# EAGLE design RPi-HAT_BUS-Controller_V0.5 (EAGLE 7.4.0)
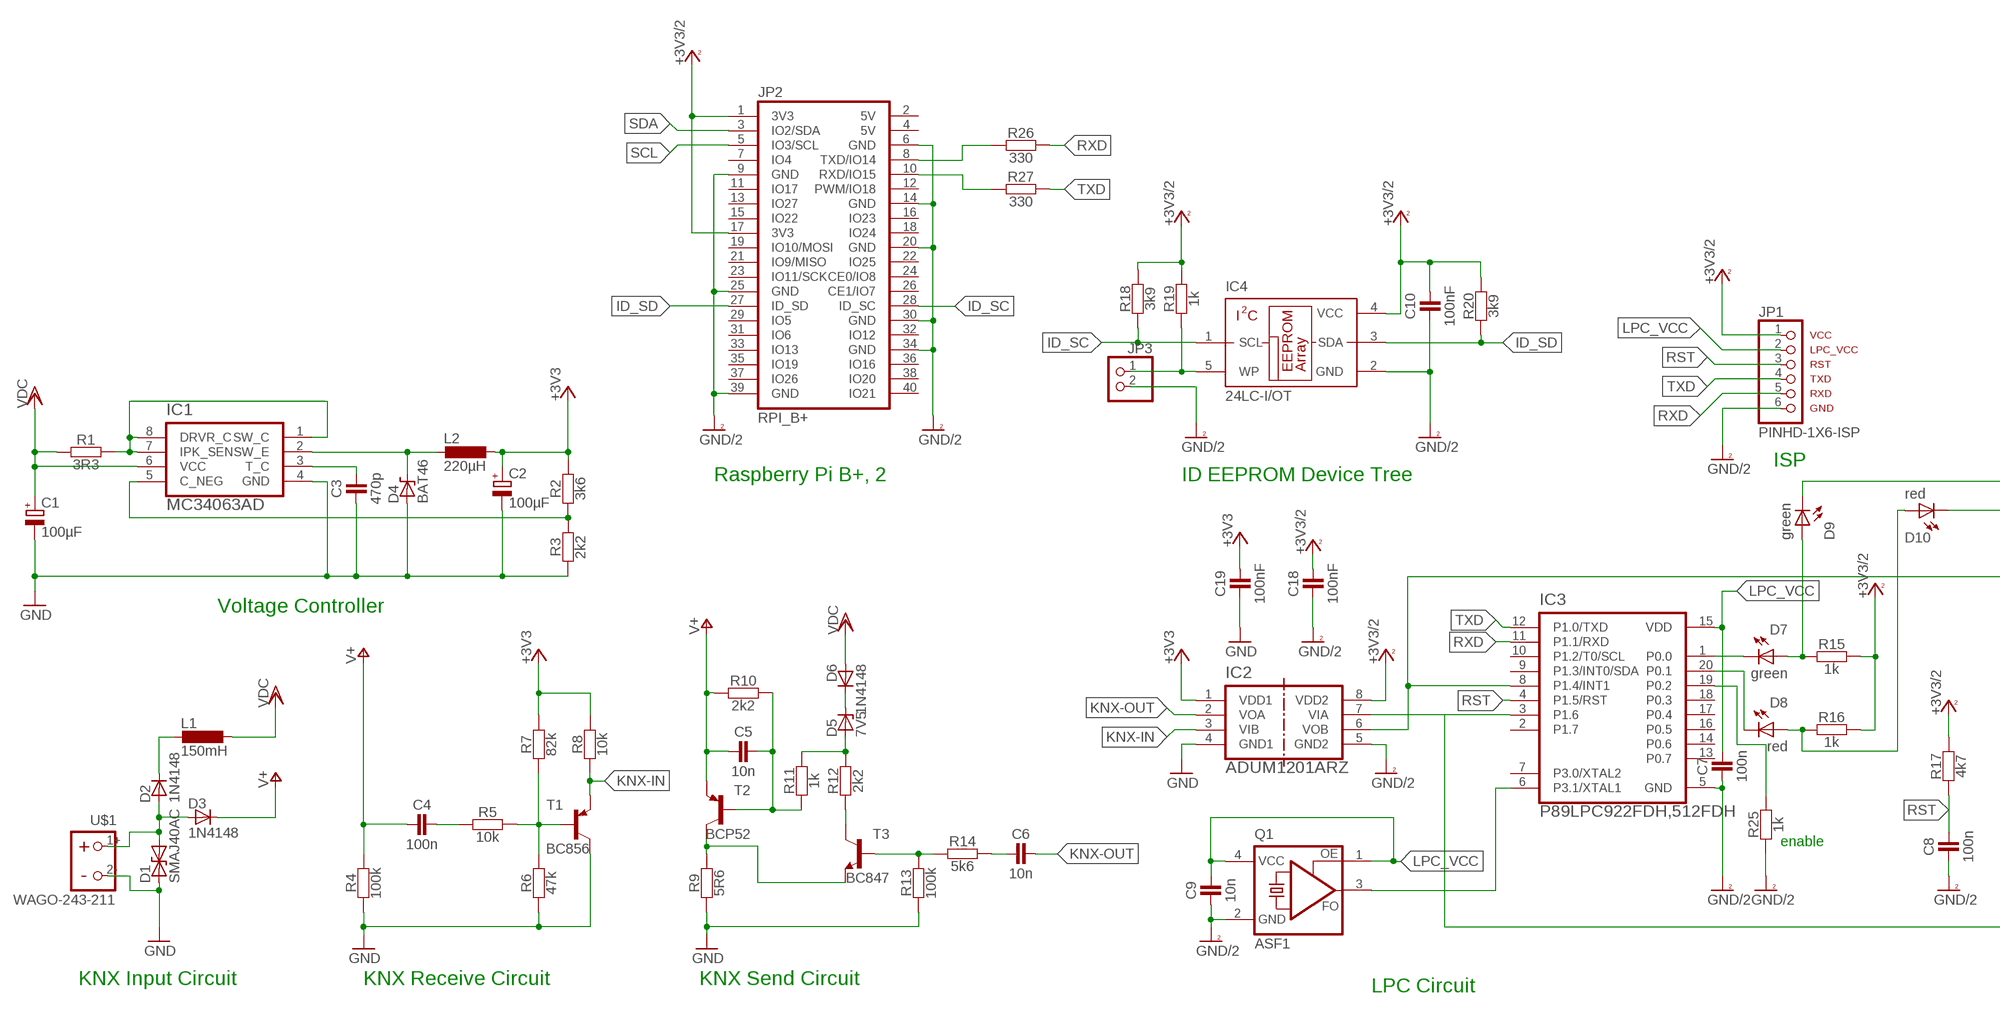
[diagram p0: schematic, sheet 1, part 1 of 2]
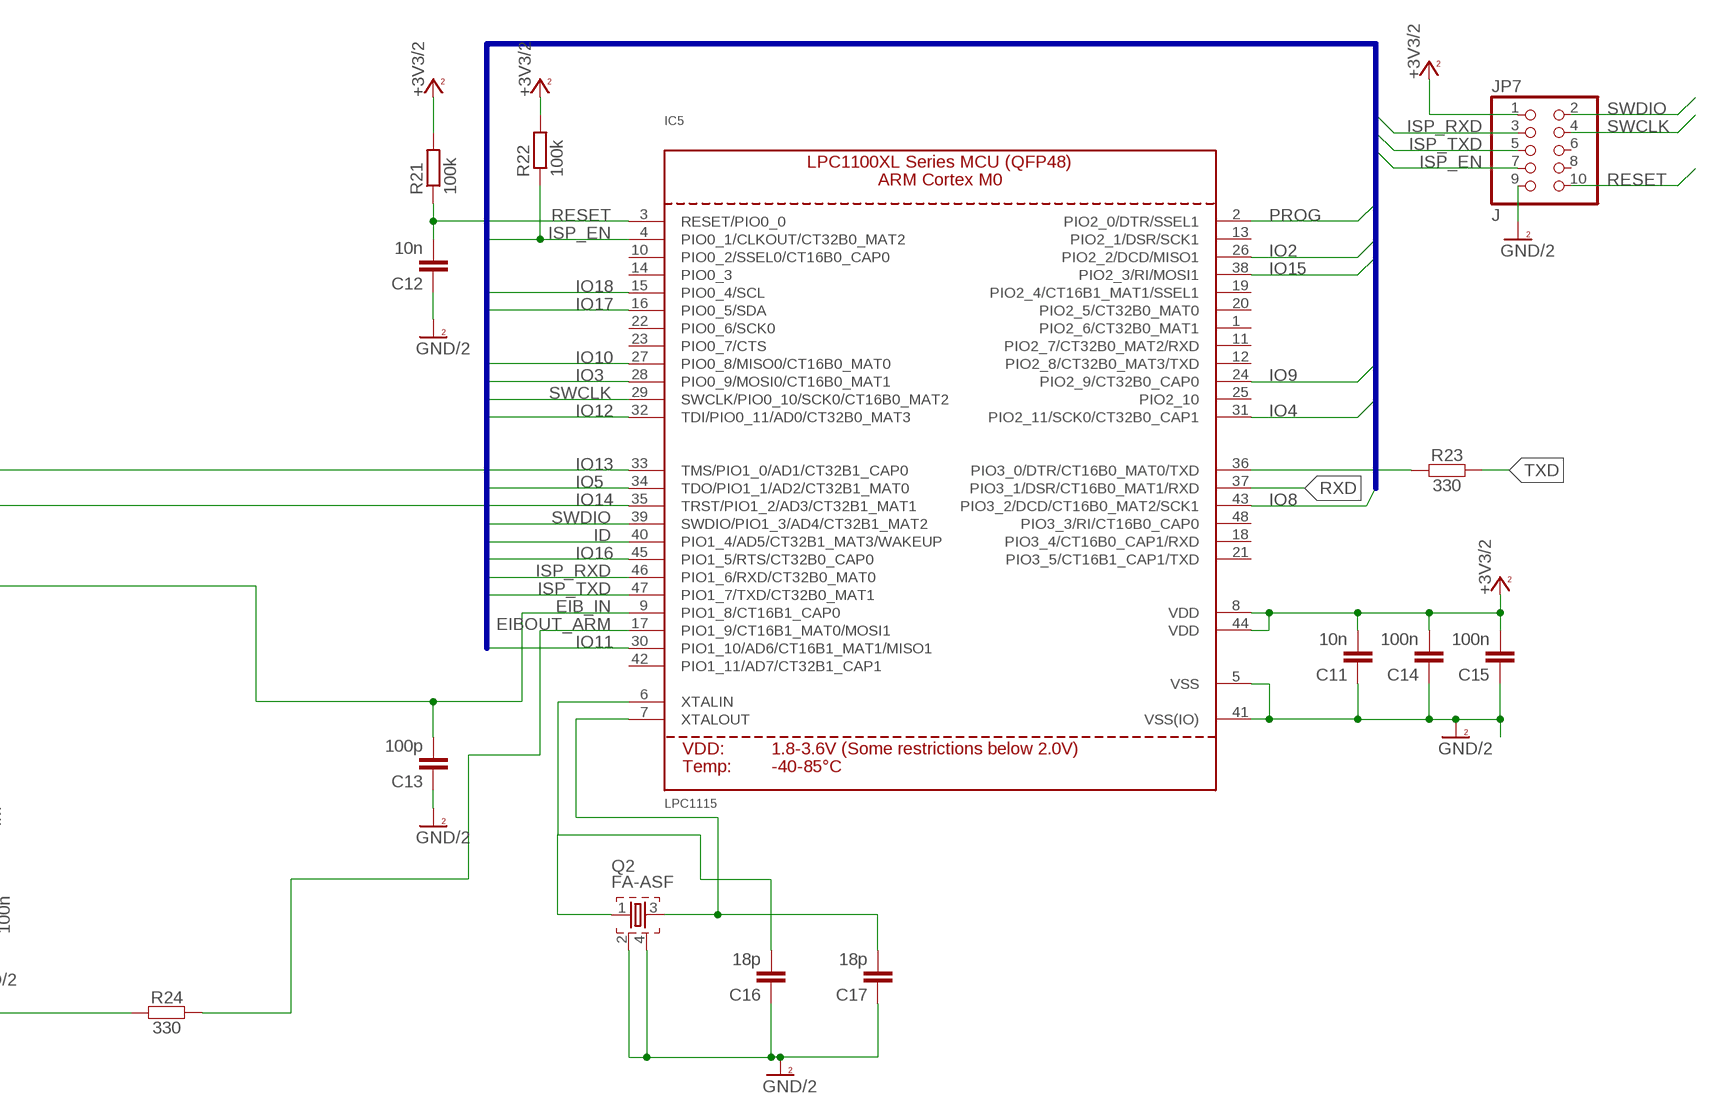
[diagram p1: schematic, sheet 1, part 2 of 2]

## Parts
C1  100µF  100µF,35V  [PANASONIC_D]
C2  100µF  100µF,6.3V  [PANASONIC_C]
C3  470p  CAPACITORC1206  [R1206]
C4  100n  CAPACITORC1206  [R1206]
C5  10n  CAPACITORC1206  [R1206]
C6  10n  CAPACITORC1206  [R1206]
C7  100n  CAPACITORC1206  [R1206]
C8  100n  CAPACITORC1206  [R1206]
C9  10n  CAPACITORC1206  [R1206]
C10  100nF  CAPACITORC1206  [R1206]
C11  10n  C-EUC1206  [C1206]
C12  10n  C-EUC1206  [C1206]
C13  100p  C-EUC1206  [C1206]
C14  100n  C-EUC1206  [C1206]
C15  100n  C-EUC1206  [C1206]
C16  18p  C-EUC1206  [C1206]
C17  18p  C-EUC1206  [C1206]
C18  100nF  CAPACITORC1206  [R1206]
C19  100nF  CAPACITORC1206  [R1206]
D1  SMAJ40AC  [DO-214AC]
D2  1N4148  1N4148MINIMELF  [MINIMELF]
D3  1N4148  1N4148MINIMELF  [MINIMELF]
D4  BAT46  [MINIMELF]
D5  7V5  Z-DIODE  [MINIMELF]
D6  1N4148  1N4148MINIMELF  [MINIMELF]
D7  green  LED1206  [CHIPLED_1206]
D8  red  LED1206  [CHIPLED_1206]
D9  green  LED1206  [CHIPLED_1206]
D10  red  LED1206  [CHIPLED_1206]
IC1  MC34063AD  [SOIC127P600X175-8N]
IC2  ADUM1201ARZ  [SOIC127P600X175-8N]
IC3  P89LPC922FDH,512FDH  [SOP65P640X110-20N]
IC4  24LC-I/OT  [SOT23-5]
IC5  LPC1115  LPC1113/4/5_QFP48_XLSERIES  [LQFP48]
JP1  PINHD-1X6-ISP  [1X06]
JP2  RPI_B+  [RPI-B+HAT]
JP3  PINHD-1X2  [1X02]
JP7  J  PINHD-2X05_2.00  [2X05M]
L1  150mH  150MH-L11PL1  [11P-L1]
L2  220µH  220µH-SMCC11.43  [2200-11.43]
Q1  ASF1  [ASF]
Q2  FA-ASF  [ASF]
R1  3R3  RESISTORR1206  [R1206]
R2  3k6  RESISTORR1206  [R1206]
R3  2k2  RESISTORR1206  [R1206]
R4  100k  RESISTORR1206  [R1206]
R5  10k  RESISTORR1206  [R1206]
R6  47k  RESISTORR1206  [R1206]
R7  82k  RESISTORR1206  [R1206]
R8  10k  RESISTORR1206  [R1206]
R9  5R6  RESISTORR1206  [R1206]
R10  2k2  RESISTORR1206  [R1206]
R11  1k  RESISTORR1206  [R1206]
R12  2k2  RESISTORR1206  [R1206]
R13  100k  RESISTORR1206  [R1206]
R14  5k6  RESISTORR1206  [R1206]
R15  1k  RESISTORR1206  [R1206]
R16  1k  RESISTORR1206  [R1206]
R17  4k7  RESISTORR1206  [R1206]
R18  3k9  RESISTORR1206  [R1206]
R19  1k  RESISTORR1206  [R1206]
R20  3k9  RESISTORR1206  [R1206]
R21  100k  R-EU_R1206  [R1206]
R22  100k  R-EU_R1206  [R1206]
R23  330  RESISTORR1206  [R1206]
R24  330  RESISTORR1206  [R1206]
R25  1k  RESISTORR1206  [R1206]
R26  330  RESISTORR1206  [R1206]
R27  330  RESISTORR1206  [R1206]
T1  BC856  PNPBC856  [SOT23]
T2  BCP52  PNPBCP52  [SOT223]
T3  BC847  NPN-BC847  [SOT23]
U$1  WAGO-243-211  [WAGO-243-211]

## Nets
+3V3: C2.+ C19.2 IC2.1(VDD1) L2.1 R2.2 R7.2 R8.2
+3V3/2: C10.2 C11.2 C14.2 C15.2 C18.2 IC2.8(VDD2) IC4.4(VCC) IC5.8(VDD) IC5.44(VDD) JP1.1 JP2.1(3V3) JP2.17(3V3) JP7.1 R15.2 R16.2 R17.2 R18.2 R19.2 R20.2 R21.2 R22.2
EIB_IN: C13.2 IC2.6(VOB) IC3.8(P1.4/INT1) IC5.9(PIO1_8/CT16B1_CAP0)
EIB_OUT: IC2.7(VIA) IC3.3(P1.6) R24.1
EIBOUT_ARM: IC5.17(PIO1_9/CT16B1_MAT0/MOSI1) R24.2
GND: C1.- C2.- C3.1 C19.1 D1.A D4.A IC1.4(GND) IC2.4(GND1) R3.1 R4.1 R6.1 R9.1 R13.1 T1.3(C) U$1.2-
GND/2: C7.1 C8.1 C9.1 C10.1 C11.1 C12.1 C13.1 C14.1 C15.1 C16.1 C17.1 C18.1 IC2.5(GND2) IC3.5(GND) IC4.2(GND) IC5.5(VSS) IC5.41(VSS(IO)) JP1.6 JP2.6(GND) JP2.9(GND) JP2.14(GND) JP2.20(GND) JP2.25(GND) JP2.30(GND) JP2.34(GND) JP2.39(GND) JP3.2 JP7.9 Q1.2(GND) Q2.2 Q2.4 R25.1
ID: IC5.40(PIO1_4/AD5/CT32B1_MAT3/WAKEUP)
ID_SC: IC4.1(SCL) JP2.28(ID_SC) R18.1
ID_SD: IC4.3(SDA) JP2.27(ID_SD) R20.1
IO2: IC5.26(PIO2_2/DCD/MISO1)
IO3: IC5.28(PIO0_9/MOSI0/CT16B0_MAT1)
IO4: IC5.31(PIO2_11/SCK0/CT32B0_CAP1)
IO5: IC5.34(TDO/PIO1_1/AD2/CT32B1_MAT0)
IO8: IC5.43(PIO3_2/DCD/CT16B0_MAT2/SCK1)
IO9: IC5.24(PIO2_9/CT32B0_CAP0)
IO10: IC5.27(PIO0_8/MISO0/CT16B0_MAT0)
IO11: IC5.30(PIO1_10/AD6/CT16B1_MAT1/MISO1)
IO12: D10.C IC5.32(TDI/PIO0_11/AD0/CT32B0_MAT3)
IO13: IC5.33(TMS/PIO1_0/AD1/CT32B1_CAP0)
IO14: IC5.35(TRST/PIO1_2/AD3/CT32B1_MAT1)
IO15: D9.C IC5.38(PIO2_3/RI/MOSI1)
IO16: IC5.45(PIO1_5/RTS/CT32B0_CAP0)
IO17: IC5.16(PIO0_5/SDA)
IO18: IC5.15(PIO0_4/SCL)
ISP_EN: IC5.4(PIO0_1/CLKOUT/CT32B0_MAT2) JP7.7 R22.1
ISP_RXD: IC5.46(PIO1_6/RXD/CT32B0_MAT0) JP7.3
ISP_TXD: IC5.47(PIO1_7/TXD/CT32B0_MAT1) JP7.5
KNX-IN: IC2.3(VIB) R8.1 T1.2(E)
KNX-OUT: C6.2 IC2.2(VOA)
LPC_VCC: C7.2 C9.2 IC3.15(VDD) JP1.2 Q1.1(OE) Q1.4(VCC)
N$1: D1.C D2.A D3.A U$1.1+
N$2: C16.2 IC5.6(XTALIN) Q2.1
N$3: IC1.5(C_NEG) R2.1 R3.2
N$4: C4.2 R5.1
N$5: D2.C L1.2
N$6: R5.2 R6.2 R7.1 T1.1(B)
N$7: C17.2 IC5.7(XTALOUT) Q2.3
N$8: IC1.1(SW_C) IC1.7(IPK_SEN) IC1.8(DRVR_C) R1.2
N$9: D8.C IC3.20(P0.1)
N$10: C3.2 IC1.3(T_C)
N$11: D7.C IC3.1(P0.0)
N$12: IC4.5(WP) JP3.1 R19.1
N$13: D4.C IC1.2(SW_E) L2.2
N$14: IC3.19(P0.2) R25.2
N$17: JP2.8(TXD/IO14) R26.1
N$18: JP2.10(RXD/IO15) R27.1
N$23: R9.2 T2.2(C) T2.4(C) T3.2(E)
N$24: C5.2 R10.2 R11.1 T2.1(B)
N$25: D5.A R11.2 R12.2
N$26: R12.1 T3.3(C)
N$28: R13.2 R14.1 T3.1(B)
N$29: C6.1 R14.2
N$31: D5.C D6.C
N$32: IC3.6(P3.1/XTAL1) Q1.3(FO)
N$35: D7.A D9.A R15.1
N$38: D8.A D10.A R16.1
PROG: IC5.2(PIO2_0/DTR/SSEL1)
RESET: C12.2 IC5.3(RESET/PIO0_0) JP7.10 R21.1
RST: C8.2 IC3.4(P1.5/RST) JP1.3 R17.1
RXD: IC3.11(P1.1/RXD) IC5.37(PIO3_1/DSR/CT16B0_MAT1/RXD) JP1.5 R26.2
SCL: JP2.5(IO3/SCL)
SDA: JP2.3(IO2/SDA)
SWCLK: IC5.29(SWCLK/PIO0_10/SCK0/CT16B0_MAT2) JP7.4
SWDIO: IC5.39(SWDIO/PIO1_3/AD4/CT32B1_MAT2) JP7.2
TXD: IC3.12(P1.0/TXD) JP1.4 R23.2 R27.2
TXD_ARM: IC5.36(PIO3_0/DTR/CT16B0_MAT0/TXD) R23.1
V+: C4.1 C5.1 D3.C R4.2 R10.1 T2.3(E)
VDD: C1.+ D6.A IC1.6(VCC) L1.1 R1.1 ; supply symbol labelled VDC
Unconnected: IC3.2(P1.7) IC3.7(P3.0/XTAL2) IC3.9(P1.3/INT0/SDA) IC3.10(P1.2/T0/SCL) IC3.13(P0.7) IC3.14(P0.6) IC3.16(P0.5) IC3.17(P0.4) IC3.18(P0.3) IC5.1(PIO2_6/CT32B0_MAT1) IC5.10(PIO0_2/SSEL0/CT16B0_CAP0) IC5.11(PIO2_7/CT32B0_MAT2/RXD) IC5.12(PIO2_8/CT32B0_MAT3/TXD) IC5.13(PIO2_1/DSR/SCK1) IC5.14(PIO0_3) IC5.18(PIO3_4/CT16B0_CAP1/RXD) IC5.19(PIO2_4/CT16B1_MAT1/SSEL1) IC5.20(PIO2_5/CT32B0_MAT0) IC5.21(PIO3_5/CT16B1_CAP1/TXD) IC5.22(PIO0_6/SCK0) IC5.23(PIO0_7/CTS) IC5.25(PIO2_10) IC5.42(PIO1_11/AD7/CT32B1_CAP1) IC5.48(PIO3_3/RI/CT16B0_CAP0) JP2.2(5V) JP2.4(5V) JP2.7(IO4) JP2.11(IO17) JP2.12(PWM/IO18) JP2.13(IO27) JP2.15(IO22) JP2.16(IO23) JP2.18(IO24) JP2.19(IO10/MOSI) JP2.21(IO9/MISO) JP2.22(IO25) JP2.23(IO11/SCK) JP2.24(CE0/IO8) JP2.26(CE1/IO7) JP2.29(IO5) JP2.31(IO6) JP2.32(IO12) JP2.33(IO13) JP2.35(IO19) JP2.36(IO16) JP2.37(IO26) JP2.38(IO20) JP2.40(IO21) JP7.6 JP7.8

## Buses
IO[1..18],RESET,SWCLK,SWDIO,ISP_EN,PROG,ID,ISP_TXD,ISP_RXD

## Notes on the sheet
- ISP
- Raspberry Pi B+, 2 | ID EEPROM Device Tree
- Voltage Controller
- enable
- KNX Input Circuit | KNX Receive Circuit | KNX Send Circuit
- LPC Circuit

## Library data of the parts
C1 = RCL_for_Selfbus-Projects:100µF,35V: Polarized Capacitor 100µF, 35V
C2 = RCL_for_Selfbus-Projects:100µF,6.3V: Polarized Capacitor 100µF, 6.3V
C3-C10 C18 C19 = RCL_for_Selfbus-Projects:CAPACITOR: Capacitor
C11 C12 = rcl:C-EU: CAPACITOR, European symbol; REICHELT: X7R-G0805 10N
C13 = rcl:C-EU: CAPACITOR, European symbol; REICHELT: NPO-G0805 100P
C14 C15 = rcl:C-EU: CAPACITOR, European symbol; REICHELT: X7R-G0805 100N
C16 C17 = rcl:C-EU: CAPACITOR, European symbol
D1 = Diode:SMAJ40AC
D2 D3 = Diode:1N4148
D4 = Diode_for_Selfbus-Projects:BAT46: Schottky Diode
D5 = Diode_for_Selfbus-Projects:Z-DIODE: Z-Diode
D6 = Diode_for_Selfbus-Projects:1N4148: Diode
D7-D10 = Diode_for_Selfbus-Projects:LED: LED
IC1 = IC_for_Selfbus-Projects:MC34063A: DC/DC converter control circuit
IC2 = IC_for_Selfbus-Projects:ADUM1201ARZ: Dual-Channel Digital Isolators; MPN: ADUM1201ARZ; OC_FARNELL: 1078200; OC_NEWARK: 19M0753; PACKAGE: SOIC-8; SUPPLIER: Analog Devices
IC3 = IC_for_Selfbus-Projects:P89LPC922FDH,512: 8-bit microcontrollers with two-clock 80C51 core 2 kB/4 kB/8 kB 3 V low-power Flash with 256-byte data RAM; MPN: P89LPC922FDH,512; OC_FARNELL: 1895067; OC_NEWARK: 70R8570; PACKAGE: TSSOP-20; SUPPLIER: NXP
IC4 = IC_for_Selfbus-Projects:24LC*: Microchip I2C EEPROM 2 Kbit - 24LC02B - 24LC02BT-I/OTDKR-ND 32 Kbit- 24LC32A - 24LC32AT-I/OTDKR-ND; DIGIKEY: 24LC32AT-I/OTDKR-ND
IC5 = microbuilder:LPC1113/4/5_QFP48_XLSERIES: LPC1113/4/5 ARM Cortex M0 MCU (50MHz) - XL Series (FBD48/3x3) LPC1115FBD48/303: Max Frequency: 50MHz Flash: 64kB SRAM: 8kB ADC: 10-bit
JP1 = Connector_for_Selfbus-Projects:PINHD-1X6-ISP: PIN HEADER - ISP for Selfbus-Controller
JP2 = Connector_for_Selfbus-Projects:RPI_B+: RPi-B+ und RPi-B2 HAT
JP3 = Connector_for_Selfbus-Projects:PINHD-1X2: PIN HEADER
JP7 = pinhead-2:PINHD-2X05: PIN HEADER; REICHELT: MPE 150-3-010
L1 = RCL_for_Selfbus-Projects:150MH-L11P: Inductor 150mH
L2 = RCL_for_Selfbus-Projects:220µH-SMCC: Inductor 220µH
Q1 = IC_for_Selfbus-Projects:ASF*: CRYSTAL CLOCK OSCILLATORS 5.0 Vdc or 3.3 Vdc - LOW PROFILE ULTRA MINIATURE CERAMIC SURFACE MOUNT Source: http://www.abracon.com/Oscillators/asf1-L-L1.pdf; OC_FARNELL: unknown; OC_NEWARK: unknown
Q2 = crystal:FA-: MHz RANGE CRYSTAL UNIT Source: Epson Toyocom
R1-R20 R23-R27 = RCL_for_Selfbus-Projects:RESISTOR: Resistor
R21 R22 = rcl:R-EU_: RESISTOR, European symbol; REICHELT: SMD-0805 100K
T1 T2 = Transistor_for_Selfbus-Projects:PNP: PNP Transistor
T3 = Transistor_for_Selfbus-Projects:NPN: NPN Transistor
U$1 = Connector_for_Selfbus-Projects:WAGO-243-211: WAGO KNX-Busklemme

## Board
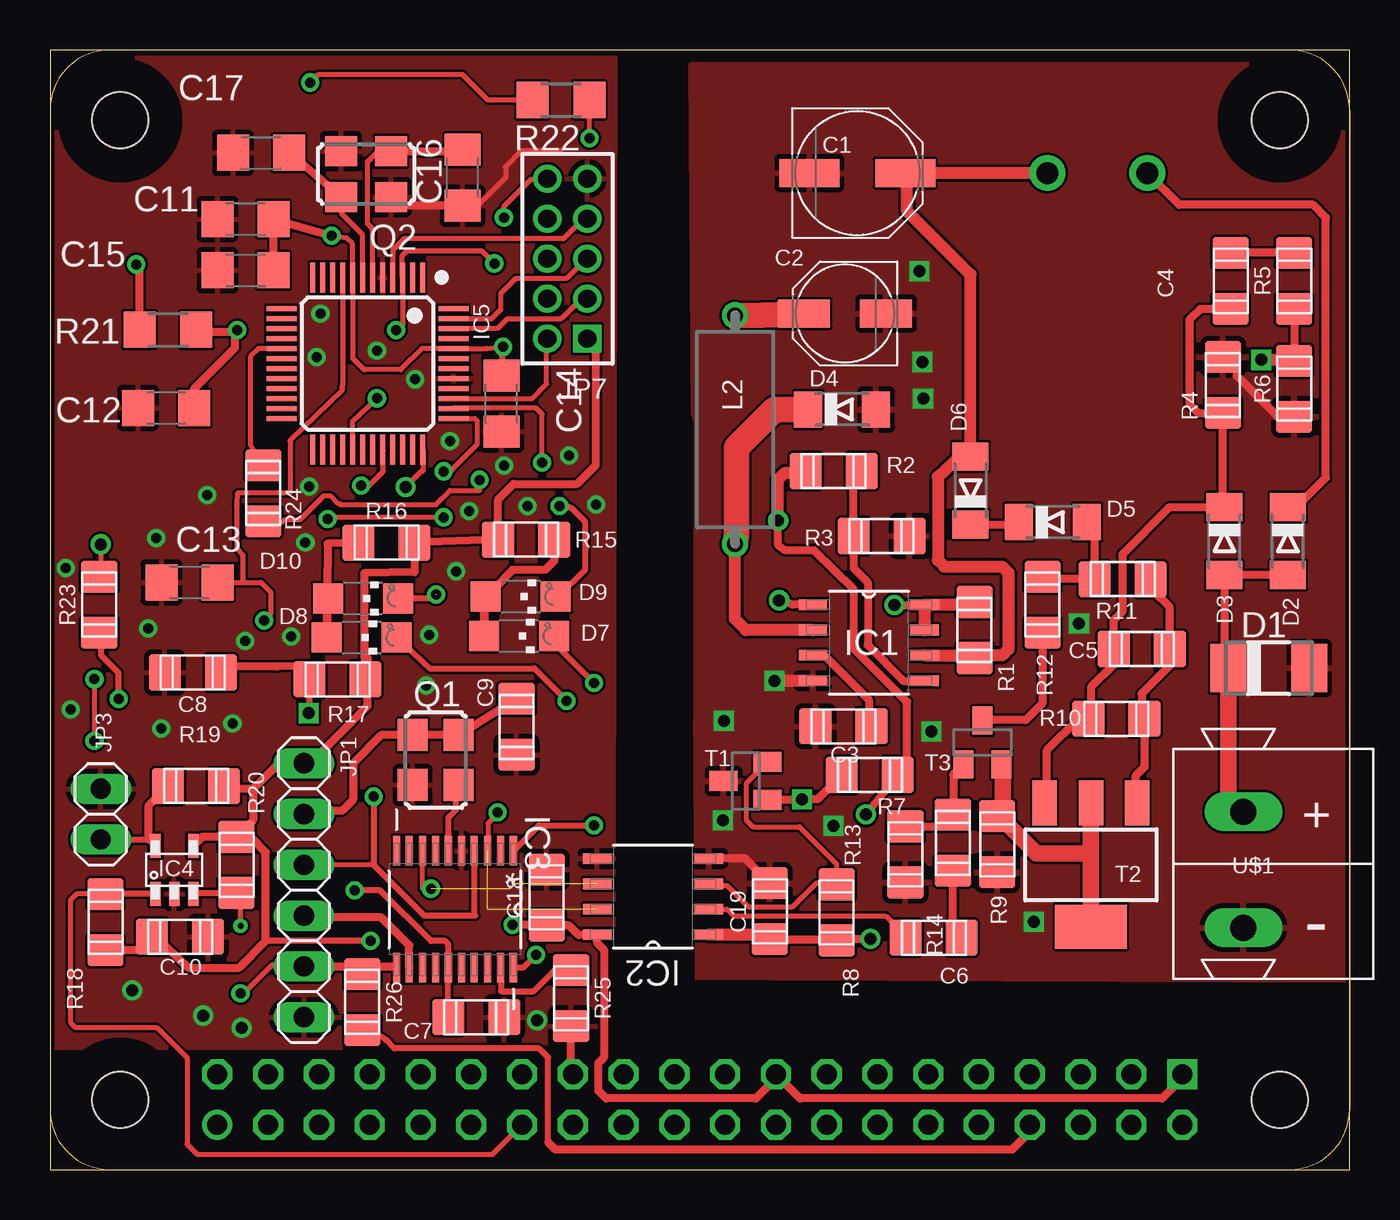
[diagram p2: board, top side]
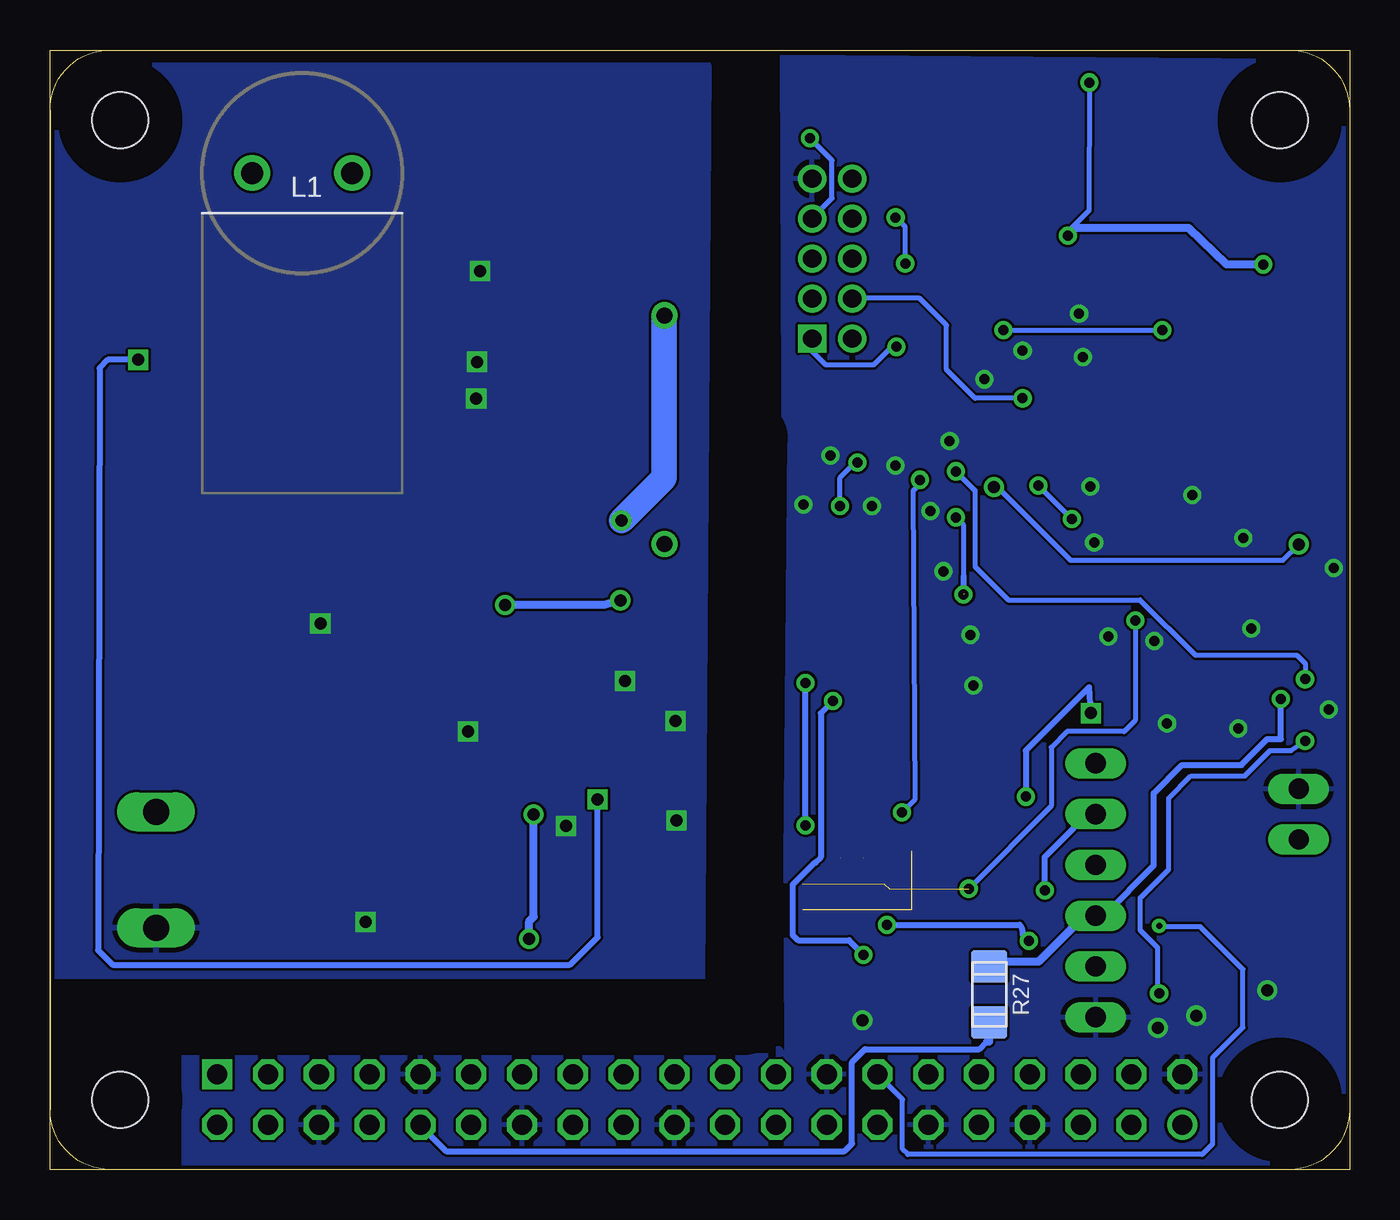
[diagram p3: board, bottom side, seen from below]

Size 65 x 56 mm. Coordinates in mm from the lower left corner, seen from the top.
Outline: 0,0 65,0 65,56 0,56 0,0
Copper layers (1*16): Top 0.035mm / dielectric 1.5mm / Bottom 0.035mm
Design rules "default *": minimum track width 8mil, minimum drill 0.3mm, track to track 5mil, track to pad 5mil, pad to pad 5mil, via to via 5mil, smd to smd 1mil, copper to edge 8mil, drill to drill 8mil, minimum pad ring 10mil, minimum via ring 8mil, stop-mask expansion 4mil, vias tented up to drill 0mil, thermal gap 10mil
tRestrict: 2 lines
bRestrict: 2 lines

### Footprints (pad centres in the part's own frame; a part is rotated, then mirrored left to right if it is on the bottom)
PANASONIC_D = smd 3 x 1.4: + 2.4,0; - -2.4,0
PANASONIC_C = smd 2.6 x 1.4: + 2.05,0; - -2.05,0
R1206 = smd 1.8 x 1.6: 1 0,1.4; 2 0,-1.4
C1206 = smd 1.6 x 1.8: 1 -1.4,0; 2 1.4,0
DO-214AC = smd 1.8 x 2.4: A 2.025,0; C -2.025,0
MINIMELF = smd 1.4 x 1.8: A 1.7,0; C -1.7,0
CHIPLED_1206 = smd 1.5 x 1.5: A -1.75,0; C 1.75,0
SOIC127P600X175-8N = smd 1.422 x 0.533: 1 -2.794,1.27; 2 -2.794,0; 3 -2.794,-1.27; 4 -2.794,-2.54; 5 2.794,-2.54; 6 2.794,-1.27; 7 2.794,0; 8 2.794,1.27
SOP65P640X110-20N = smd 1.473 x 0.356: 1 -2.286,2.54; 2 -2.286,1.905; 3 -2.286,1.245; 4 -2.286,0.584; 5 -2.286,-0.051; 6 -2.286,-0.711; 7 -2.286,-1.346; 8 -2.286,-2.007; 9 -2.286,-2.667; 10 -2.286,-3.302; 11 3.556,-3.302; 12 3.556,-2.667; 13 3.556,-2.007; 14 3.556,-1.346; 15 3.556,-0.711; 16 3.556,-0.051; 17 3.556,0.584; 18 3.556,1.245; 19 3.556,1.905; 20 3.556,2.54
SOT23-5 = smd 1.2 x 0.6: 1 -1.2,0.95; 2 -1.2,0; 3 -1.2,-0.95; 4 1.2,-0.95; 5 1.2,0.95
LQFP48 = smd 1.5 x 0.25: 1 -4.3,2.75; 2 -4.3,2.25; 3 -4.3,1.75; 4 -4.3,1.25; 5 -4.3,0.75; 6 -4.3,0.25; 7 -4.3,-0.25; 8 -4.3,-0.75; 9 -4.3,-1.25; 10 -4.3,-1.75; 11 -4.3,-2.25; 12 -4.3,-2.75; 25 4.3,-2.75; 26 4.3,-2.25; 27 4.3,-1.75; 28 4.3,-1.25; 29 4.3,-0.75; 30 4.3,-0.25; 31 4.3,0.25; 32 4.3,0.75; 33 4.3,1.25; 34 4.3,1.75; 35 4.3,2.25; 36 4.3,2.75 | smd 0.25 x 1.5: 13 -2.75,-4.3; 14 -2.25,-4.3; 15 -1.75,-4.3; 16 -1.25,-4.3; 17 -0.75,-4.3; 18 -0.25,-4.3; 19 0.25,-4.3; 20 0.75,-4.3; 21 1.25,-4.3; 22 1.75,-4.3; 23 2.25,-4.3; 24 2.75,-4.3; 37 2.75,4.3; 38 2.25,4.3; 39 1.75,4.3; 40 1.25,4.3; 41 0.75,4.3; 42 0.25,4.3; 43 -0.25,4.3; 44 -0.75,4.3; 45 -1.25,4.3; 46 -1.75,4.3; 47 -2.25,4.3; 48 -2.75,4.3
1X06 = drill 1.016 long: 1 -6.35,0; 2 -3.81,0; 3 -1.27,0; 4 1.27,0; 5 3.81,0; 6 6.35,0
RPI-B+HAT = drill 1 square: 1 56.63,4.77 | drill 1 octagon: 2 56.63,2.23; 3 54.09,4.77; 4 54.09,2.23; 5 51.55,4.77; 6 51.55,2.23; 7 49.01,4.77; 8 49.01,2.23; 9 46.47,4.77; 10 46.47,2.23; 11 43.93,4.77; 12 43.93,2.23; 13 41.39,4.77; 14 41.39,2.23; 15 38.85,4.77; 16 38.85,2.23; 17 36.31,4.77; 18 36.31,2.23; 19 33.77,4.77; 20 33.77,2.23; 21 31.23,4.77; 22 31.23,2.23; 23 28.69,4.77; 24 28.69,2.23; 25 26.15,4.77; 26 26.15,2.23; 27 23.61,4.77; 28 23.61,2.23; 29 21.07,4.77; 30 21.07,2.23; 31 18.53,4.77; 32 18.53,2.23; 33 15.99,4.77; 34 15.99,2.23; 35 13.45,4.77; 36 13.45,2.23; 37 10.91,4.77; 38 10.91,2.23; 39 8.37,4.77 | drill 1: 40 8.37,2.23 | hole 2.8: 3.5,3.5; 3.5,52.5; 61.5,52.5; 61.5,3.5
1X02 = drill 1.016 long: 1 -1.27,0; 2 1.27,0
2X05M = drill 0.914 square: 1 -4,-1 | drill 0.914: 2 -4,1; 3 -2,-1; 4 -2,1; 5 0,-1; 6 0,1; 7 2,-1; 8 2,1; 9 4,-1; 10 4,1
11P-L1 = drill 1.1 pad 1.778: 1 -2.5,0; 2 2.5,0
2200-11.43 = drill 0.8 pad 1.27: 1 -5.715,0; 2 5.715,0
ASF = smd 1.6 x 1.5: 1 -1.25,-1.15; 2 1.25,-1.15; 3 1.25,1.15; 4 -1.25,1.15
R1206' = smd 1.6 x 1.803: 1 -1.422,0; 2 1.422,0
SOT23 = smd 1 x 1.4: 1 -0.95,-1.1; 2 0.95,-1.1; 3 0,1.1
SOT223 = smd 1.219 x 2.235: 1 -2.311,-3.099; 2 0,-3.099; 3 2.311,-3.099 | smd 3.6 x 2.2: 4 0,3.099
WAGO-243-211 = drill 1.3 long: 1+ 0,2.65; 2- 0,-3.15

### Placement (x,y rotation side)
C1  40.39,49.85 0 top
C2  39.76,42.81 180 top
C3  39.69,22.17 90 top
C4  59.05,44.45 180 top
C5  54.61,26.04 90 top
C6  44.21,11.6 270 top
C7  21.32,7.62 270 top
C8  7.14,24.86 90 top
C9  23.34,22.15 180 top
C10  6.5,11.65 270 top
C11  9.78,47.54 0 top
C12  5.81,38.09 0 top
C13  6.99,29.37 0 top
C14  22.58,38.32 90 top
C15  9.78,44.98 0 top
C16  20.64,49.61 90 top
C17  10.55,50.86 0 top
C18  24.84,13.6 0 top
C19  36,12.92 0 top
D1  60.96,25.08 0 top
D2  61.91,31.43 270 top
D3  58.74,31.43 270 top
D4  39.62,38.02 0 top
D5  50.16,32.38 0 top
D6  46.04,33.97 90 top
D7  23.45,26.69 0 top
D8  15.6,26.61 0 top
D9  23.55,28.65 0 top
D10  15.66,28.57 0 top
IC1  40.96,26.99 0 top
IC2  30.16,13.02 180 top
IC3  20.64,13.65 270 top
IC4  6.22,14.99 90 top
IC5  15.88,40.32 270 top
JP1  12.7,13.97 270 top
JP2  0,0 0 top
JP3  2.54,17.78 90 top
JP7  25.88,45.56 90 top
L1  52.39,49.85 180 bottom
L2  34.26,37.01 270 top
Q1  19.29,20.48 270 top
Q2  15.81,49.8 180 top
R1  46.24,26.99 180 top
R2  39.19,34.94 270 top
R3  41.59,31.69 270 top
R4  58.67,39.24 0 top
R5  62.23,44.45 0 top
R6  62.23,39.05 180 top
R7  41.01,19.74 90 top
R8  39.34,12.87 0 top
R9  47.38,16.27 180 top
R10  53.34,22.54 90 top
R11  53.66,29.53 270 top
R12  49.64,28.26 180 top
R13  42.79,15.76 180 top
R14  45.16,16.34 0 top
R15  23.81,31.51 270 top
R16  16.83,31.35 90 top
R17  14.38,24.52 90 top
R18  2.78,12.38 0 top
R19  7.3,19.18 90 top
R20  9.33,15.24 180 top
R21  100k  [R1206']  5.9,42.01 180 top
R22  100k  [R1206']  25.56,53.5 180 top
R23  2.46,28.26 0 top
R24  10.67,33.83 180 top
R25  26.06,8.57 180 top
R26  15.62,8.38 180 top
R27  18.02,8.76 180 bottom
T1  34.8,19.43 90 top
T2  52.07,15.24 180 top
T3  46.65,21.36 0 top
U$1  59.69,15.24 0 top

### Tracks (layer width: path | path; a pad name or v marks a point on that pad's centre or on a via)
+3V3  (via drill 0.6)
  Top 0.406: 42.42,19.73 R7.2 | R7.2 42.41,19.87 42.86,20.32 42.86,23.39 40.21,26.05 40.21,29.01 38.21,30.96 36.78,30.96 36.42,31.24 v36.42,32.46 | C19.2 39.29,11.52 | 39.29,11.52 R8.2 | 39.29,11.52 39.32,11.54 v41.03,11.54 | v40.8,17.75 42.37,19.66 R7.2
  Top 0.61: v36.42,32.46 36.42,34.52 36.77,34.86 37.72,34.86 R2.2 | C19.2 35.77,11.75 IC2.1
  Top 1.27: C2.+ 35.65,42.74 L2.1
  Bottom 0.406: v41.03,11.54 41.03,12.42 40.8,12.65 v40.8,17.75
  Bottom 1.27: v36.42,32.46 34.29,34.59 34.29,42.7 L2.1
+3V3/2  (via drill 0.5)
  Top 0.254: v14.08,46.71 14.84,46.59 15.12,46.31 IC5.8 15.16,44.59 15.16,40.56 15.72,40.01 17.54,40.01 18.61,41.07 IC5.44 21.87,41.07 v22.67,41.15 | R22.2 21.91,53.5 20.64,54.77 13.41,54.77 v13.02,54.37
  Top 0.305: v16.03,11.43 10.79,11.43 | C14.2 v22.67,41.15
  Top 0.406: 10.16,19.05 11.43,20.32 JP1.1 13.21,20.83 13.53,20.83 15.88,23.18 15.88,25.59 R17.2 15.72,25.75 15.72,29.84 18.23,29.89 R16.2 R15.2 22.41,33.52 23.18,34.29 26.35,34.29 27.3,35.24 27.3,41.13 JP7.1 | 10.16,19.05 10.16,17.46 R20.2 | R20.2 7.63,16.64 IC4.4 | JP2.1 56.63,4.56 55.63,3.56 37.52,3.56 JP2.17 36.31,4.56 35.31,3.56 27.81,3.56 27.43,3.94 27.43,5.33 27.74,5.64 27.74,10.97 27.37,11.34 IC2.8 | 10.16,19.05 8.83,19.05 R19.2 | R20.2 9.46,16.51 10.16,16.51 10.79,15.88 10.79,11.43 9.46,10.1 6.92,10.1 5.75,11.19 C10.2 4.97,10.98 R18.2 2.83,10.98 | 27.37,11.72 IC2.8 | C15.2 C11.2 v14.08,46.71 | R21.2 4.48,45.11 v4.31,45.27 | IC2.8 27.36,11.73 26.44,11.73 25.97,12.2 C18.2 24.8,12.25 v23.14,12.25
  Bottom 0.254: v22.67,41.15 23.02,41.04 23.81,40.24 26.19,40.24 26.91,40.96 26.91,41.53 JP7.1 | v13.02,54.37 13.03,47.97 14.08,46.91 v14.08,46.71
  Bottom 0.305: v23.14,12.25 16.5,12.25 arc45 16.36,11.75 v16.03,11.43
  Bottom 0.406: v4.31,45.27 6.14,45.27 8.04,47.09 13.7,47.09 v14.08,46.71
EIB_IN  (via drill 0.5)  (4 unrouted)
  Top 0.254: v19.05,14.05 18.63,14.05 IC3.8 | IC5.9 14.62,39.29 14.61,39.13 14.61,38.95 12,36.46 12,33.83 9.37,33.83 9.34,33.26 9.34,31.05 9.64,30.75 9.64,29.37 | 8.41,29.4 C13.2 9.64,29.37 | 9.64,29.37 10.56,29.37 11.03,28.89 11.03,27.78 v10.72,27.46
  Bottom 0.254: v10.72,27.46 10.72,22.46 11.27,21.91 14.13,21.91 14.92,21.11 14.92,18.18 v19.05,14.05
EIB_OUT  (via drill 0.5)  (2 unrouted)
  Top 0.254: v22.38,17.86 22.38,17.78 21.91,17.3 21.91,15.96 IC3.3 | v21.48,34.5 21.49,33.97 20,33.97 19.29,33.26 14.53,33.26 14.53,33.29 14.45,33.29 14.06,33.68 13.68,33.68 12.5,32.5 11.73,32.5 11.62,32.38 11.1,32.38 R24.1
  Bottom 0.254: v21.48,34.5 21.48,34.3 21.83,33.95 21.75,18.49 v22.38,17.86
EIBOUT_ARM
  Top 0.254: IC5.17 10.44,41.07 10.02,40.65 10.02,36.26 R24.2
GND  (via drill 0.6)
  Top 0.254: 33.01,15.51 IC2.4
  Top 0.406: R6.1 61.41,37.65 59.36,39.7 59.36,39.96 R4.1 | C19.1 34.76,15.56 IC2.4
  Top 0.61: IC1.4 36.35,24.45 v36.25,24.43
  other vias: 51.47,27.3 33.71,22.44 33.66,17.46 44.08,21.91 49.21,12.38 43.64,40.4 43.68,38.57 43.48,44.93 39.18,17.2
  pour Bottom: 32.38,9.53 65.02,9.53 65.02,9.65 64.71,55.24 32.07,55.24
  pour Top: 32.38,9.53 65.02,9.53 64.71,55.24 32.07,55.24
GND/2  (via drill 0.5, 0.6)  (2 unrouted)
  Top 0.254: JP7.9 26.88,49.64 | 25.56,50.96 23.57,50.96 22.78,50.16 22.78,49.61 21.43,48.26 20.69,48.26 C16.1
  Top 0.406: C16.1 17.45,48.21 | JP2.25 26.06,4.86 R25.1
  other vias: 9.58,7.09 7.67,7.7 13.34,40.64 16.35,40.96 20,36.43 27.3,33.26 25.96,35.72 12.77,31.37 7.86,33.73 20.95,32.94 20.32,29.92 9.13,22.3 5.56,22.07 1.03,23.02 9.76,26.43 12.06,26.67 5.32,31.59 18.97,26.75 18.81,24.21 23.89,33.18 4.12,8.96 0.79,30.08 4.92,27.07 18.26,39.53 13.53,42.81 12.95,34.16 24.36,7.47 22.72,35.22
  pour Bottom: 28.37,55.67 0.16,55.44 0,22.61 0,0 58.29,0 58.29,5.71 28.57,5.71 28.57,6.1 28.13,5.62
  pour Top: 28.29,55.59 0.08,55.59 0.15,6.12 58.45,6.12 58.25,6.74 28.17,6.74
ID_SC
  Top 0.254: JP2.28 22.14,0.76 7.37,0.76 6.86,1.27 6.86,5.59 5.33,7.11 1.27,7.11 1.02,7.37 1.02,13.46 1.34,13.78 R18.1
  Top 0.305: IC4.1 R18.1
ID_SD  (via drill 0.3)
  Top 0.254: v9.53,12.19 9.53,13.02 R20.1
  Top 0.305: IC4.3 7.23,13.84 R20.1
  Bottom 0.254: JP2.27 22.35,3.51 22.35,1.02 22.1,0.76 7.37,0.76 6.86,1.27 6.86,5.59 5.33,7.11 5.33,10.02 7.46,12.14 9.48,12.14 v9.53,12.19
IO12  (via drill 0.5)  (1 unrouted)
  Top 0.254: v19.68,32.62 13.97,32.62 v13.89,32.54 | v15.56,34.21 15.95,34.21 16.67,34.92 16.67,35.98 IC5.32
  Top 0.305: 19.29,28.79 19.08,28.57 D10.C
  Bottom 0.254: 19.29,29.69 19.29,32.23 v19.68,32.62 | v13.89,32.54 v15.56,34.21
  Bottom 0.305: 19.29,29.69 19.3,29.69 v19.3,28.77
IO15  (via drill 0.5)
  Top 0.254: v24.62,35.36 24.62,37.78 24.3,38.1 20.2,38.1 IC5.38
  Top 0.305: D9.C 25.41,28.65 26.78,30.02 26.78,32.38 26.06,33.11 25.55,33.11 v25.48,33.18
  Bottom 0.254: v25.48,33.18 25.48,34.61 24.69,35.4 v24.62,35.36
ISP_EN  (via drill 0.5)
  Top 0.254: JP7.7 26.69,47.56 25.68,46.55 17.7,46.55 17.14,46 17.14,44.64 IC5.4 | v26.99,51.59 R22.1
  Bottom 0.254: JP7.7 26.88,47.58 25.88,48.58 25.88,50.48 v26.99,51.59
ISP_RXD
  Top 0.254: JP7.3 26.57,43.56 25.56,42.55 22.86,42.55 22.38,42.07 IC5.46
ISP_TXD
  Top 0.254: JP7.5 26.83,45.56 25.84,44.57 23.3,44.57 22.54,43.81 22.54,43.02 22.07,42.55 20.2,42.55 IC5.47
KNX-IN
  Top 0.254: IC2.3 33.45,14.29 33.53,14.21 33.87,14.21 34.94,13.14 37.15,13.14 38.33,14.33 39.25,14.33 R8.1 39.34,15.29 37.49,17.14 35.17,17.14 34.82,17.49 34.82,19.31 T1.2
KNX-OUT
  Top 0.254: IC2.2 33.88,13.02 34.21,12.69 41.81,12.69 42.94,11.56 C6.2
LPC_VCC  (via drill 0.5)
  Top 0.305: v15.24,13.97 16.51,13.97 19.05,11.43 19.76,11.43 19.93,11.27 IC3.15 19.92,10.02 19.92,8.41 20.19,8.15 C7.2
  Top 0.406: C9.2 Q1.4 Q1.1 16.57,21.73 15.16,20.32 15.16,18.49 14.61,17.94 12.86,17.94 JP1.2
  Bottom 0.305: v15.24,13.97 15.24,15.64 13.41,17.46 13.02,17.46 JP1.2
N$1
  Top 0.406: D2.A D3.A 58.74,25.28 D1.C
  Top 0.813: D1.C 58.94,18.64 U$1.1+
N$2
  Top 0.254: IC5.6 16.12,47.06 15.88,47.31 15.88,50.4 16.35,50.88 17.01,50.88
  Top 0.406: 20.55,50.92 C16.2 20.57,50.95 Q2.1 17.01,50.89 17.01,50.88
N$3
  Top 0.406: IC1.5 42.69,24.45 40.91,26.23 40.91,29.36 40.19,30.08 R3.2 40.19,34.4 40.58,34.78 40.58,34.92 R2.1
N$4
  Top 0.406: R5.1 59.66,45.85 59.69,46.35 59.31,46.35 C4.2
N$5
  Top 0.406: D2.C 62.34,33.13 63.82,34.61 63.82,47.62 63.18,48.26 56.48,48.26 L1.2
N$6  (via drill 0.6)
  Top 0.305: R6.2 62.23,39.98
  Top 0.406: R5.2 R6.2 | R7.1 38.39,18.52 v37.6,18.52 36.5,18.52 36.46,18.48 T1.1
  Top 0.61: v60.58,40.5 62.18,40.5 R6.2
  Bottom 0.305: v60.58,40.5 62.1,40.5 62.52,40.08 62.6,10.97 61.87,10.25 38.98,10.25 37.6,11.62 v37.6,18.52
N$7
  Top 0.254: IC5.7 15.62,46.76 14.61,47.78 14.61,48.56
  Top 0.406: 14.61,48.56 14.61,48.6 Q2.3 C17.2
N$8  (via drill 0.6)
  Top 0.406: 46.54,28.26 R1.2 | IC1.1 37.15,28.26 v36.47,28.47 | v42.24,28.25 43.5,28.25 IC1.8
  Top 0.61: 46.54,28.26 IC1.8 IC1.7
  Bottom 0.406: v36.47,28.47 37.29,28.25 v42.24,28.25
N$9  (via drill 0.5)
  Top 0.305: D8.C 19,25.07 24.23,25.07 25.83,23.47 v25.83,23.43 | v24.31,10.74 23.66,10.1 IC3.20
  Bottom 0.305: v25.83,23.43 26.44,22.82 26.44,15.62 26.71,15.35 26.75,15.35 27.85,14.25 27.85,11.73 27.58,11.47 25.03,11.47 v24.31,10.74 24.35,10.78 24.35,10.82
N$10
  Top 0.406: IC1.3 38.73,25.72 40.96,23.5 40.96,22.04 C3.2
N$11  (via drill 0.5)
  Top 0.305: IC3.1 24.46,17.22 v27.2,17.22 | v27.2,24.35 25.2,26.35 D7.C
  Bottom 0.305: v27.2,17.22 v27.2,24.35
N$12
  Top 0.305: JP3.1 4.95,16.51 IC4.5
  Top 0.406: 4.95,16.51 4.95,18.22 R19.1
N$13
  Top 0.61: IC1.2 34.81,26.99 34.25,27.55 34.25,30.62 L2.2
  Top 1.27: D4.C 36.23,38.02 34.33,36.12 34.33,31.74 L2.2
N$14
  Top 0.305: IC3.19 22.55,10.08 22.55,8.91 24.19,8.91 25.22,9.94 25.45,9.94 25.48,9.97
  Top 0.406: 25.48,9.97 R25.2
N$17
  Top 0.305: 24.92,1.37 24.92,5.6 24.46,6.06 17.22,6.06 16.8,6.48 15.96,7 R26.1
  Top 0.406: JP2.8 49.01,1.88 48.12,0.99 25.3,0.99 24.92,1.37
N$18
  Bottom 0.305: JP2.10 46.47,2.2 45.19,0.91 25.26,0.91 24.88,1.29 24.88,5.37 24.23,6.02 18.52,6.02 18.14,6.4
  Bottom 0.406: 18.14,6.4 18.02,6.4 R27.1
N$23
  Top 0.813: T2.2 52.07,15.73 | 52.07,15.73 T2.4 | 52.07,15.73 51.99,15.81 49.34,15.81 47.48,17.67 R9.2 47.38,17.7 47.66,17.98 47.66,20.2 T3.2
N$24
  Top 0.406: T2.1 54.29,18.43 54.29,19.68 54.74,20.13 R10.2 54.61,22.67 54.61,23.81 56.01,25.21 C5.2 56.01,28.13 55.24,28.89 55.24,29.34 R11.1
N$25
  Top 0.406: D5.A 52.26,31.99 R11.2 49.66,29.53 R12.2
N$26
  Top 0.406: R12.1 49.64,23.32 48.81,22.48 46.66,22.48 T3.3
N$28
  Top 0.406: R13.2 44.69,17.16 R14.1 45.19,17.77 45.19,19.75 T3.1
N$29
  Top 0.406: C6.1 45.16,11.63 R14.2
N$31
  Top 0.406: D6.C 48.35,32.27 D5.C
N$32
  Top 0.305: IC3.6 19.93,17.52 arc-45 20,17.7 20.32,18.02 20.32,19 arc-45 20.39,19.18 Q1.3
N$35
  Top 0.305: D9.A 21.8,26.78 D7.A
  Top 0.406: R15.1 25.21,30.44 24.77,29.99 23.13,29.99 22.15,28.97 21.67,28.5 D7.A
N$38
  Top 0.305: D10.A 13.91,26.78 D8.A
  Top 0.406: R16.1 13.88,31.31 D8.A
RESET  (via drill 0.5)
  Top 0.254: v17.3,41.99 17.62,42.23 IC5.3 17.62,45.72 17.86,45.96 21.59,45.96 v22.23,45.32 | v22.7,47.62 22.7,48.18 24.05,49.53 24.84,49.53 JP7.10
  Top 0.406: C12.2 7.21,39.06 9.26,41.11 9.26,41.88 | 9.26,41.88 v9.37,41.99 | 9.26,41.88 7.45,41.88 R21.1
  Bottom 0.254: v17.3,41.99 v9.37,41.99 | v22.23,45.32 22.23,47.15 v22.7,47.62
RST  (via drill 0.5, 0.6)
  Top 0.254: 16.19,15.24 JP1.3
  Top 0.305: IC3.4 21.22,12.75 21.27,12.7 18.73,12.7 16.19,15.24 v16.19,18.65 | 12.37,25.18 R17.1 13.01,24.77 v12.94,22.82
  Top 0.406: 12.37,25.18 11.35,25.16 9,25.16 C8.2
  Bottom 0.305: v12.94,22.82 13.02,24.13 16.19,20.95 v16.19,18.65
RXD  (via drill 0.5)
  Top 0.254: IC5.37 21.24,37.57 21.35,37.47 21.35,36.27 20,34.92 v19.68,34.92 | v9.53,8.81 9.68,8.81 11.11,10.24 12.62,10.24 JP1.5 | v2.22,24.53 v2.22,21.43
  Top 0.406: JP1.5 15.35,10.16 | 15.35,10.16 17.27,10.16 IC3.11 | R26.2 15.59,10.11 15.35,10.16
  Bottom 0.254: v19.68,34.92 18.73,33.97 18.73,30.16 17.07,28.5 10.48,28.5 7.7,25.72 2.62,25.72 2.22,25.32 v2.22,24.53 | 2.38,21.67 v2.22,21.43 2.94,20.95 3.97,20.95 5.24,19.68 7.94,19.68 9.05,18.57 9.05,15 10.48,13.57 10.48,11.99 9.6,11.11 9.6,8.89 v9.53,8.81
SWCLK  (via drill 0.5)
  Top 0.254: IC5.29 15.12,37.43 v16.35,38.58
  Bottom 0.254: v16.35,38.58 18.73,38.58 20.16,40.01 20.16,42.23 21.51,43.58 24.86,43.58 JP7.4
SWDIO
  Top 0.254: IC5.39 24.13,38.57 24.84,39.29 24.84,41.53 JP7.2
TXD  (via drill 0.5)
  Top 0.305: v3.43,23.55 3.43,24.84 2.55,25.72 2.55,26.77 R23.2
  Top 0.406: IC3.12 17.97,11.21 16.57,12.61 12.79,12.61 JP1.4
  Bottom 0.305: JP1.4 12.29,12.7 9.79,15.2 9.79,18.82 8.38,20.23 5.41,20.23 4.12,21.53 3.43,21.53 v3.43,23.55
  Bottom 0.406: R27.2 17.73,10.16 17.49,10.4 15.54,10.4 13.26,12.69 12.71,12.69 JP1.4
TXD_ARM  (via drill 0.6)
  Top 0.254: IC5.36 18.65,36.02 18.65,34.92 18.57,34.92 v17.78,34.13 | v2.54,31.27 2.54,29.74 R23.1
  Bottom 0.254: v17.78,34.13 17.62,34.13 13.97,30.48 3.33,30.48 v2.54,31.27
V+
  Top 0.406: T2.3 49.85,18.43 49.85,20.95 51.44,22.54 R10.1 52.07,22.67 52.07,24.13 53.21,25.27 C5.1 53.21,27.49 53.66,27.94 53.66,30.8 55.99,33.13 D3.C 58.67,33.2 R4.2 57.45,37.84 57,38.29 57,42.52 57.53,43.05 C4.1
VDD
  Top 0.406: 44.13,49.85 43.81,50.16 43.1,50.16 C1.+ 42.86,49.77 | 46.54,25.72 R1.1 46.8,25.72 | D6.A 45.52,35.67
  Top 0.61: L1.1 44.13,49.85 | IC1.6 46.54,25.72 | D6.A 46.04,44.77 42.86,47.94 42.86,49.77 | 45.52,35.67 44.41,34.65 44.41,30.48 44.73,30.16 47.62,30.16 47.94,29.84 47.94,26.04 47.62,25.72 46.8,25.72